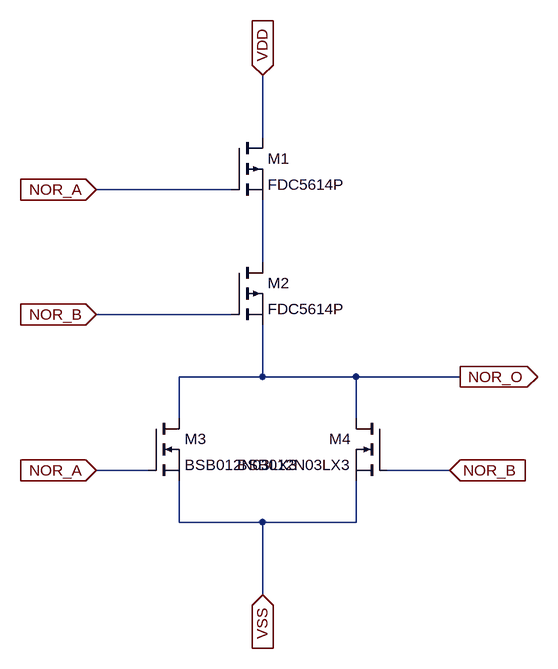
[diagram p0: schematic m_Nor.asc]
m_Nor.asc, the LTspice schematic file:
Version 4
SHEET 1 880 680
WIRE 144 -224 144 -320
WIRE 96 -144 -112 -144
WIRE 144 -32 144 -128
WIRE 96 48 -112 48
WIRE 144 144 144 64
WIRE 144 144 16 144
WIRE 288 144 144 144
WIRE 448 144 288 144
WIRE 16 208 16 144
WIRE 288 208 288 144
WIRE -32 288 -112 288
WIRE 432 288 336 288
WIRE 16 368 16 304
WIRE 144 368 16 368
WIRE 288 368 288 304
WIRE 288 368 144 368
WIRE 144 480 144 368
FLAG 144 480 VSS
IOPIN 144 480 In
FLAG 144 -320 VDD
IOPIN 144 -320 In
FLAG 448 144 NOR_O
IOPIN 448 144 Out
FLAG -112 288 NOR_A
IOPIN -112 288 In
FLAG -112 -144 NOR_A
IOPIN -112 -144 In
FLAG -112 48 NOR_B
IOPIN -112 48 In
FLAG 432 288 NOR_B
IOPIN 432 288 In
SYMBOL pmos 96 -224 R0
SYMATTR InstName M1
SYMATTR Value FDC5614P
SYMBOL pmos 96 -32 R0
SYMATTR InstName M2
SYMATTR Value FDC5614P
SYMBOL nmos -32 208 R0
SYMATTR InstName M3
SYMATTR Value BSB012N03LX3
SYMBOL nmos 336 208 M0
SYMATTR InstName M4
SYMATTR Value BSB012N03LX3

The netlist it stands for:
* m_Nor.asc
M1 VDD NOR_A N001 N001 FDC5614P
M2 N001 NOR_B NOR_O NOR_O FDC5614P
M3 NOR_O NOR_A VSS VSS BSB012N03LX3
M4 NOR_O NOR_B VSS VSS BSB012N03LX3
.model NMOS NMOS
.model PMOS PMOS
.lib standard.mos
.backanno
.end